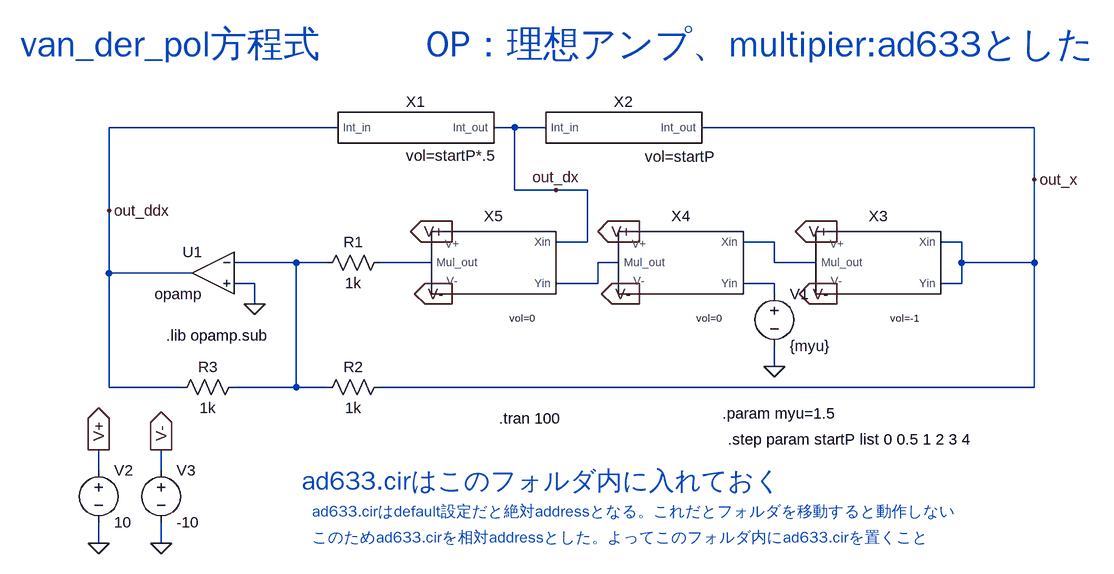
[diagram p0: schematic van_der_pol-lv2.asc]
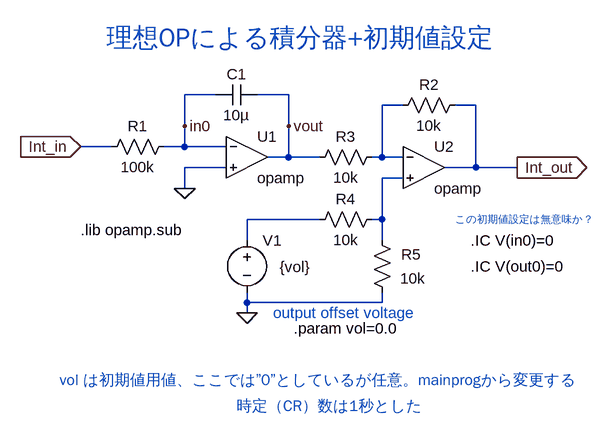
[diagram p1: sub-circuit int_lv2.asc]
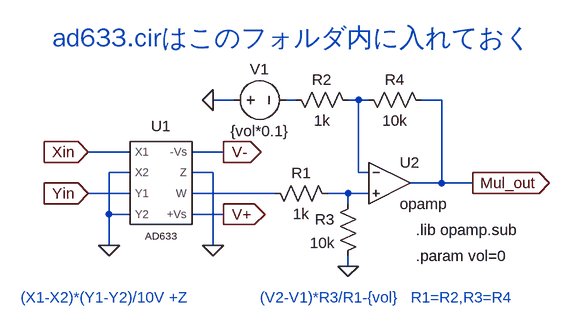
[diagram p2: sub-circuit mul_lv2.asc]
van_der_pol-lv2.asc, the LTspice schematic file:
Version 4.1
SHEET 1 940 692
WIRE -192 -128 -544 -128
WIRE 80 -128 48 -128
WIRE 128 -128 80 -128
WIRE 880 -128 368 -128
WIRE 880 -48 880 -128
WIRE 80 -32 80 -128
WIRE 144 -32 80 -32
WIRE 192 -32 144 -32
WIRE -544 0 -544 -128
WIRE 192 48 192 -32
WIRE 192 48 144 48
WIRE 480 48 432 48
WIRE 768 48 736 48
WIRE -256 80 -352 80
WIRE -208 80 -256 80
WIRE -48 80 -128 80
WIRE 240 80 208 80
WIRE 480 80 480 48
WIRE 544 80 480 80
WIRE 768 80 768 48
WIRE 880 80 880 -48
WIRE 880 80 768 80
WIRE -544 96 -544 0
WIRE -416 96 -544 96
WIRE -320 112 -352 112
WIRE 208 112 208 80
WIRE 208 112 144 112
WIRE 480 112 432 112
WIRE 768 112 768 80
WIRE 768 112 736 112
WIRE 480 128 480 112
WIRE -320 144 -320 112
WIRE 480 240 480 208
WIRE -544 272 -544 96
WIRE -432 272 -544 272
WIRE -256 272 -256 80
WIRE -256 272 -352 272
WIRE -208 272 -256 272
WIRE 880 272 880 80
WIRE 880 272 -128 272
WIRE -560 400 -560 368
WIRE -464 400 -464 368
WIRE -560 512 -560 480
WIRE -464 512 -464 480
FLAG -320 144 0
FLAG 480 240 0
FLAG 880 -48 out_x
FLAG 144 -32 out_dx
FLAG -544 0 out_ddx
FLAG -560 512 0
FLAG -464 512 0
FLAG -560 368 V+
IOPIN -560 368 Out
FLAG -464 368 V-
IOPIN -464 368 Out
FLAG -16 32 V+
IOPIN -16 32 Out
FLAG 272 32 V+
IOPIN 272 32 Out
FLAG 576 32 V+
IOPIN 576 32 Out
FLAG -16 128 V-
IOPIN -16 128 Out
FLAG 272 128 V-
IOPIN 272 128 Out
FLAG 576 128 V-
IOPIN 576 128 Out
SYMBOL OpAmps\\opamp -384 32 M0
SYMATTR InstName U1
SYMATTR SpiceLine Aol=10Meg
SYMATTR SpiceLine2 GBW=1G
SYMBOL res -112 64 R90
WINDOW 0 0 56 VBottom 2
WINDOW 3 32 56 VTop 2
SYMATTR InstName R1
SYMATTR Value 1k
SYMBOL res -112 256 R90
WINDOW 0 0 56 VBottom 2
WINDOW 3 32 56 VTop 2
SYMATTR InstName R2
SYMATTR Value 1k
SYMBOL res -336 256 R90
WINDOW 0 0 56 VBottom 2
WINDOW 3 32 56 VTop 2
SYMATTR InstName R3
SYMATTR Value 1k
SYMBOL voltage 480 112 R0
WINDOW 123 0 0 Left 0
WINDOW 39 0 0 Left 0
SYMATTR InstName V1
SYMATTR Value {myu}
SYMBOL INT_lv2 -80 -128 R0
WINDOW 39 62 59 Bottom 2
WINDOW 1 -80 32 Left 1
SYMATTR SpiceLine vol=startP*.5
SYMATTR InstName X1
SYMBOL INT_lv2 240 -128 R0
WINDOW 39 95 60 Bottom 2
WINDOW 1 -80 32 Left 1
SYMATTR SpiceLine vol=startP
SYMATTR InstName X2
SYMBOL voltage -560 384 R0
WINDOW 123 0 0 Left 0
WINDOW 39 0 0 Left 0
SYMATTR InstName V2
SYMATTR Value 10
SYMBOL voltage -464 384 R0
WINDOW 123 0 0 Left 0
WINDOW 39 0 0 Left 0
SYMATTR InstName V3
SYMATTR Value -10
SYMBOL mul_lv2 640 80 M0
WINDOW 39 -63 85 Left 1
SYMATTR SpiceLine vol=-1
SYMATTR InstName X3
SYMBOL mul_lv2 336 80 M0
WINDOW 39 -63 85 Left 1
SYMATTR SpiceLine vol=0
SYMATTR InstName X4
SYMBOL mul_lv2 48 80 M0
WINDOW 39 -63 85 Left 1
SYMATTR SpiceLine vol=0
SYMATTR InstName X5
TEXT -456 192 Left 2 !.lib opamp.sub
TEXT 56 320 Left 2 !.tran 100
TEXT 400 312 Left 2 !.param myu=1.5
TEXT 408 352 Left 2 !.step param startP list 0 0.5 1 2 3 4
TEXT -248 416 Left 4 ;ad633.cirはこのフォルダ内に入れておく
TEXT -232 464 Left 2 ;ad633.cirはdefault設定だと絶対addressとなる。これだとフォルダを移動すると動作しない
TEXT -232 504 Left 2 ;このためad633.cirを相対addressとした。よってこのフォルダ内にad633.cirを置くこと
TEXT -56 -256 Left 5 ;OP：理想アンプ、multipier:ad633とした
TEXT -680 -256 Left 5 ;van_der_pol方程式

int_lv2.asc, the sub-circuit schematic file:
Version 4.1
SHEET 1 880 680
WIRE 16 -128 -32 -128
WIRE 128 -128 80 -128
WIRE 304 -112 272 -112
WIRE 416 -112 384 -112
WIRE -32 -80 -32 -128
WIRE 128 -80 128 -128
WIRE -144 -48 -192 -48
WIRE -32 -48 -32 -80
WIRE -32 -48 -64 -48
WIRE 32 -48 -32 -48
WIRE 128 -32 128 -80
WIRE 128 -32 96 -32
WIRE 176 -32 128 -32
WIRE 272 -32 272 -112
WIRE 272 -32 256 -32
WIRE 304 -32 272 -32
WIRE 32 -16 -32 -16
WIRE 416 -16 416 -112
WIRE 416 -16 368 -16
WIRE 480 -16 416 -16
WIRE 304 0 272 0
WIRE -32 16 -32 -16
WIRE 176 64 64 64
WIRE 272 64 272 0
WIRE 272 64 256 64
WIRE 64 96 64 64
WIRE 272 96 272 64
WIRE 64 192 64 176
WIRE 272 192 272 176
WIRE 272 192 64 192
WIRE 64 208 64 192
FLAG -192 -48 Int_in
IOPIN -192 -48 In
FLAG 128 -80 vout
FLAG 480 -16 Int_out
IOPIN 480 -16 Out
FLAG -32 -80 in0
FLAG -32 16 0
FLAG 64 208 0
SYMBOL cap 16 -112 R270
WINDOW 0 32 32 VTop 2
WINDOW 3 0 32 VBottom 2
SYMATTR InstName C1
SYMATTR Value 10µ
SYMBOL res -48 -64 R90
WINDOW 0 0 56 VBottom 2
WINDOW 3 32 56 VTop 2
SYMATTR InstName R1
SYMATTR Value 100k
SYMBOL OpAmps\\opamp 64 -96 R0
SYMATTR InstName U1
SYMATTR SpiceLine Aol=10meg
SYMATTR SpiceLine2 GBW=1g
SYMBOL OpAmps\\opamp 336 -80 R0
SYMATTR InstName U2
SYMATTR SpiceLine Aol=10meg
SYMATTR SpiceLine2 GBW=1g
SYMBOL res 400 -128 R90
WINDOW 0 0 56 VBottom 2
WINDOW 3 32 56 VTop 2
SYMATTR InstName R2
SYMATTR Value 10k
SYMBOL res 272 -48 R90
WINDOW 0 0 56 VBottom 2
WINDOW 3 32 56 VTop 2
SYMATTR InstName R3
SYMATTR Value 10k
SYMBOL res 272 48 R90
WINDOW 0 0 56 VBottom 2
WINDOW 3 32 56 VTop 2
SYMATTR InstName R4
SYMATTR Value 10k
SYMBOL res 288 192 R180
WINDOW 0 -44 74 Left 2
WINDOW 3 -51 37 Left 2
SYMATTR InstName R5
SYMATTR Value 10k
SYMBOL voltage 64 80 R0
WINDOW 123 0 0 Left 0
WINDOW 39 0 0 Left 0
WINDOW 3 50 57 Left 2
SYMATTR Value {vol}
SYMATTR InstName V1
TEXT -192 80 Left 2 !.lib opamp.sub
TEXT 136 232 Left 2 !.param vol=0.0
TEXT -224 312 Left 2 ;vol は初期値用値、ここでは”0”としているが任意。mainprogから変更する
TEXT 48 352 Left 2 ;時定（CR）数は1秒とした
TEXT 104 208 Left 2 ;output offset voltage
TEXT 408 96 Left 2 !.IC V(in0)=0
TEXT 408 136 Left 2 !.IC V(out0)=0
TEXT 384 64 Left 1 ;この初期値設定は無意味か？
TEXT -152 -216 Left 4 ;理想OPによる積分器+初期値設定

mul_lv2.asc, the sub-circuit schematic file:
Version 4.1
SHEET 1 880 680
WIRE 208 16 176 16
WIRE 304 16 288 16
WIRE 400 16 384 16
WIRE 416 16 400 16
WIRE 528 16 496 16
WIRE 48 96 -16 96
WIRE 192 96 144 96
WIRE 48 128 16 128
WIRE 176 128 144 128
WIRE 400 128 400 16
WIRE 416 128 400 128
WIRE 528 144 528 16
WIRE 528 144 480 144
WIRE 576 144 528 144
WIRE 48 160 -16 160
WIRE 272 160 144 160
WIRE 384 160 352 160
WIRE 416 160 384 160
WIRE 384 176 384 160
WIRE 16 192 16 128
WIRE 48 192 16 192
WIRE 192 192 144 192
WIRE 16 240 16 192
WIRE 176 240 176 128
WIRE 384 272 384 256
FLAG 576 144 Mul_out
IOPIN 576 144 Out
FLAG 384 272 0
FLAG 192 192 V+
IOPIN 192 192 Out
FLAG 192 96 V-
IOPIN 192 96 Out
FLAG -16 96 Xin
IOPIN -16 96 In
FLAG -16 160 Yin
IOPIN -16 160 In
FLAG 16 240 0
FLAG 176 240 0
FLAG 176 16 0
SYMBOL res 256 144 M90
WINDOW 0 0 56 VBottom 2
WINDOW 3 32 56 VTop 2
SYMATTR InstName R1
SYMATTR Value 1k
SYMBOL res 288 0 M90
WINDOW 0 0 56 VBottom 2
WINDOW 3 32 56 VTop 2
SYMATTR InstName R2
SYMATTR Value 1k
SYMBOL res 400 160 M0
SYMATTR InstName R3
SYMATTR Value 10k
SYMBOL res 400 0 M90
WINDOW 0 0 56 VBottom 2
WINDOW 3 32 56 VTop 2
SYMATTR InstName R4
SYMATTR Value 10k
SYMBOL OpAmps\\opamp 448 80 R0
SYMATTR InstName U2
SYMBOL voltage 192 16 M90
WINDOW 0 -32 56 VBottom 2
WINDOW 3 32 56 VTop 2
WINDOW 123 0 0 Left 0
WINDOW 39 0 0 Left 0
SYMATTR InstName V1
SYMATTR Value {vol*0.1}
SYMBOL AD633 80 144 R0
SYMATTR InstName U1
TEXT -120 320 Left 2 ;(X1-X2)*(Y1-Y2)/10V +Z
TEXT 248 320 Left 2 ;(V2-V1)*R3/R1-{vol}   R1=R2,R3=R4
TEXT 488 256 Left 2 !.param vol=0
TEXT 488 216 Left 2 !.lib opamp.sub
TEXT -72 -80 Left 4 ;ad633.cirはこのフォルダ内に入れておく

The netlist it stands for:
* van_der_pol-lv2.asc
X§U1 N002 0 out_ddx opamp Aol=10Meg GBW=1G  ; pins invin noninvin out
R1 N003 N002 1k
R2 out_x N002 1k
R3 N002 out_ddx 1k
V1 N005 0 {myu}
X§X1 out_ddx out_dx int_lv2 params: vol=startP*.5
X§X2 out_dx out_x int_lv2 params: vol=startP
V2 V+ 0 10
V3 V- 0 -10
X§X3 out_x out_x N001 V+ V- mul_lv2 params: vol=-1
X§X4 N001 N005 N004 V+ V- mul_lv2 params: vol=0
X§X5 out_dx N004 N003 V+ V- mul_lv2 params: vol=0

* block symbol definitions
.subckt int_lv2 Int_in Int_out
C1 in0 vout 10µ
R1 in0 Int_in 100k
X§U1 in0 0 vout opamp Aol=10meg GBW=1g  ; pins invin noninvin out
X§U2 N001 N002 Int_out opamp Aol=10meg GBW=1g  ; pins invin noninvin out
R2 Int_out N001 10k
R3 N001 vout 10k
R4 N002 N003 10k
R5 0 N002 10k
V1 N003 0 {vol}
.lib opamp.sub
.param vol=0.0
* vol は初期値用値、ここでは”0”としているが任意。mainprogから変更する
* 時定（CR）数は1秒とした
* output offset voltage
.IC V(in0)=0
.IC V(out0)=0
* この初期値設定は無意味か？
* 理想OPによる積分器+初期値設定
.ends int_lv2

.subckt mul_lv2 Xin Yin Mul_out V+ V-
R1 N003 N004 1k
R2 N001 N002 1k
R3 N004 0 10k
R4 N002 Mul_out 10k
X§U2 N002 N004 Mul_out opamp Aol=100K GBW=10Meg  ; pins invin noninvin out
V1 0 N001 {vol*0.1}
X§U1 Xin 0 Yin 0 V- 0 N003 V+ AD633  ; pins X1 X2 Y1 Y2 -Vs Z W +Vs
* (X1-X2)*(Y1-Y2)/10V +Z
* (V2-V1)*R3/R1-{vol}   R1=R2,R3=R4
.param vol=0
.lib opamp.sub
* ad633.cirはこのフォルダ内に入れておく
.ends mul_lv2

.lib opamp.sub
.tran 100
.param myu=1.5
.step param startP list 0 0.5 1 2 3 4
* ad633.cirはこのフォルダ内に入れておく
* ad633.cirはdefault設定だと絶対addressとなる。これだとフォルダを移動すると動作しない
* このためad633.cirを相対addressとした。よってこのフォルダ内にad633.cirを置くこと
* OP：理想アンプ、multipier:ad633とした
* van_der_pol方程式
.lib ad633.cir
.backanno
.end